# Altium schematic sheet RA-01SH_MOD.SchDoc
size A4
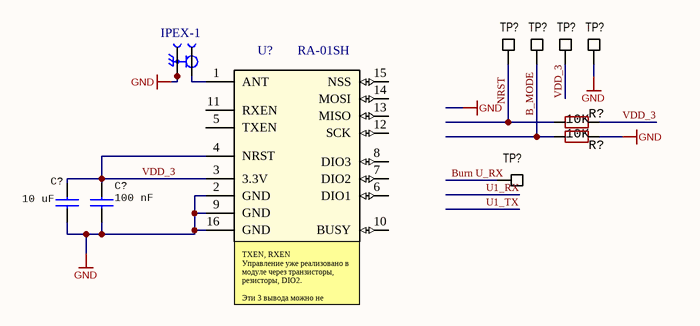
[diagram p0: RA-01SH_MOD.SchDoc]

## Parts
(Parts that share a designator on the sheet are numbered #1, #2 ... from top to bottom, then left to right.)
C?#1  value 10 uF  [0603_CAPASITOR]  (hidden comment: Capacitor)
C?#2  value 100 nF  [0603_CAPASITOR]  (hidden comment: Capacitor)
J?  IPEX-1  [IPEX-1_connector]
R?#1  value 10K  [0603_RESISTOR]  (hidden comment: resistor)
R?#2  value 10K  [0603_RESISTOR]  (hidden comment: resistor)
TP?#1  NRST  [TEST_POINT_SMD_1mm]  (value not drawn)  (no BOM)
TP?#2  B_MODE  [TEST_POINT_SMD_1mm]  (value not drawn)  (no BOM)
TP?#3  VDD  [TEST_POINT_SMD_1mm]  (value not drawn)  (no BOM)
TP?#4  G  [TEST_POINT_SMD_1mm]  (value not drawn)  (no BOM)
TP?#5  Burn U_RX  [TEST_POINT_SMD_1mm]  (value not drawn)  (no BOM)
U?  RA-01SH  [RA-01SH]

## Nets
GND: C?#1.1 C?#2.1 J?.2(GROUND) J?.3(GROUND) R?#2.1 TP?#4.1 U?.2(GND) U?.9(GND) U?.16(GND)
B_MODE: R?#2.2 TP?#2.1
Burn U_RX: TP?#5.1
NRST: R?#1.2 TP?#1.1
VDD_3: C?#1.2 C?#2.2 R?#1.1 TP?#3.1 U?.3(3.3V) U?.4(NRST)
NetJ?_1: J?.1(SIGNAL) U?.1(ANT)

Not connected (* = marked no-connect by the designer): U? 5(TXEN) 6(DIO1) 7(DIO2) 8(DIO3) 10(BUSY) 11(RXEN) 12(SCK) 13(MISO) 14(MOSI) 15(NSS)

## Notes on the sheet
- (near U?) TXEN, RXEN
  Управление уже реализовано в модуле через транзисторы, резисторы, DIO2.
  Эти 3 вывода можно не подключать.
  Только убедиться что модуль (SX1262) переведен програмно в режим автоматического RX/TX
  "SetDio2AsRfSwitchCtrl(1);"
  DIO1 Обычно используется как тригер вызывающий прерывание у подключенного к нему МК
  DIO3 Теоретически тоже можно настроить как EXTI TRIG для МК

## Library data of the parts
C?#1 = capacitor_smd: Voltage: 10V; Tolerance: ±20%; Dielectric: X5R/X7R; Package: 0603
C?#2 = capacitor_smd: Voltage: 6V; Tolerance: ±20%; Dielectric: X5R/X7R; Package: 0603
J? = IPEX-1: 1 POS Vertical SMD Small form factor with big performance through 6 GHz connector,MHF, RF, micro-coaxial MHF I Receptacle; MF: I-PEX; MP: 20279-001E-03; SnapEDA_Link: https://www.snapeda.com/parts/20279-001E-03/I-PEX/view-part/?ref=snap; Package: IPEX-1; Value: *; Check_prices: https://www.snapeda.com/parts/20279-001E-03/I-PEX/view-part/?ref=eda
R?#1 R?#2 = resistor: Tolerance: ±5%; Power: 0.125W; Package: 0603
TP?#1-TP?#5 = test_point_single
U? = RA-01SH: LoRa Module; / Semtech SX1262; / 803–930 MHz; / +22 dBm; SPI;; Manufacturer_Name: Ai-Thinker; Voltage: 3.3V; Type: RF; Package: SMD-16 2mm Pitch